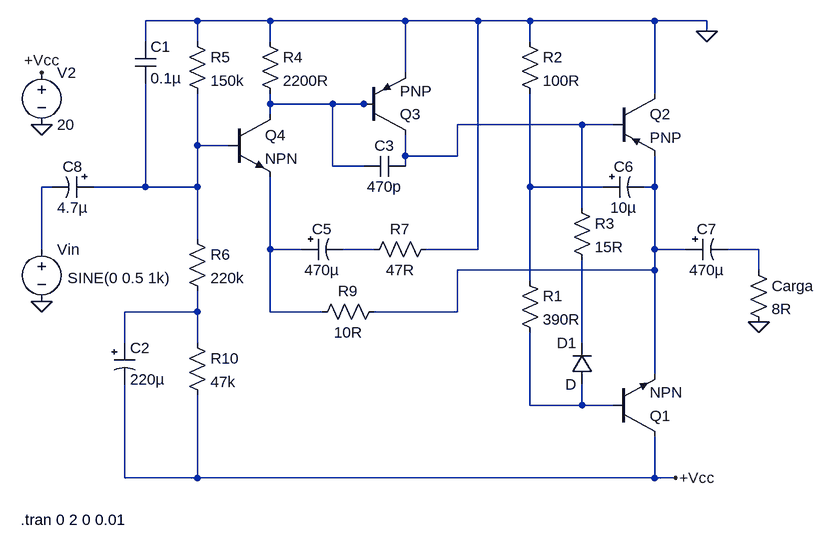
[diagram p0: schematic amp_20W.asc]
amp_20W.asc, the LTspice schematic file:
Version 4
SHEET 1 1108 736
WIRE 144 -48 64 -48
WIRE 256 -48 144 -48
WIRE 464 -48 256 -48
WIRE 576 -48 464 -48
WIRE 656 -48 576 -48
WIRE 848 -48 656 -48
WIRE 928 -48 848 -48
WIRE 928 -32 928 -48
WIRE 64 -16 64 -48
WIRE 144 -16 144 -48
WIRE 256 -16 256 -48
WIRE 656 -16 656 -48
WIRE 464 32 464 -48
WIRE 848 64 848 -48
WIRE 256 80 256 64
WIRE 352 80 256 80
WIRE 400 80 352 80
WIRE 416 80 400 80
WIRE 256 96 256 80
WIRE 736 112 544 112
WIRE 784 112 736 112
WIRE 144 144 144 64
WIRE 192 144 144 144
WIRE 464 160 464 128
WIRE 544 160 544 112
WIRE 544 160 464 160
WIRE 352 176 352 80
WIRE 400 176 352 176
WIRE 464 176 464 160
WIRE -80 208 -96 208
WIRE 64 208 64 48
WIRE 64 208 -16 208
WIRE 144 208 144 144
WIRE 144 208 64 208
WIRE 656 208 656 64
WIRE 768 208 656 208
WIRE 848 208 848 160
WIRE 848 208 832 208
WIRE 736 240 736 112
WIRE 144 288 144 208
WIRE -96 304 -96 208
WIRE 256 304 256 192
WIRE 304 304 256 304
WIRE 416 304 368 304
WIRE 576 304 576 -48
WIRE 576 304 496 304
WIRE 848 304 848 208
WIRE 896 304 848 304
WIRE 1008 304 960 304
WIRE 848 336 848 304
WIRE 848 336 544 336
WIRE 1008 336 1008 304
WIRE 656 352 656 208
WIRE 144 400 144 368
WIRE 144 400 32 400
WIRE 256 400 256 304
WIRE 336 400 256 400
WIRE 544 400 544 336
WIRE 544 400 416 400
WIRE 32 448 32 400
WIRE 144 448 144 400
WIRE 736 448 736 320
WIRE 848 496 848 336
WIRE 656 544 656 432
WIRE 736 544 736 512
WIRE 736 544 656 544
WIRE 784 544 736 544
WIRE 32 656 32 512
WIRE 144 656 144 528
WIRE 144 656 32 656
WIRE 848 656 848 592
WIRE 848 656 144 656
WIRE 880 656 848 656
FLAG 928 -32 0
FLAG 1008 416 0
FLAG 880 656 +Vcc
FLAG -96 32 +Vcc
FLAG -96 112 0
FLAG -96 384 0
SYMBOL npn 784 592 M180
SYMATTR InstName Q1
SYMBOL pnp 784 64 R0
SYMATTR InstName Q2
SYMBOL pnp 400 128 M180
SYMATTR InstName Q3
SYMBOL npn 192 96 R0
SYMATTR InstName Q4
SYMBOL res 640 336 R0
SYMATTR InstName R1
SYMATTR Value 390R
SYMBOL res 640 -32 R0
SYMATTR InstName R2
SYMATTR Value 100R
SYMBOL res 720 224 R0
SYMATTR InstName R3
SYMATTR Value 15R
SYMBOL res 240 -32 R0
SYMATTR InstName R4
SYMATTR Value 2200R
SYMBOL res 128 -32 R0
SYMATTR InstName R5
SYMATTR Value 150k
SYMBOL res 128 272 R0
SYMATTR InstName R6
SYMATTR Value 220k
SYMBOL res 512 288 R90
WINDOW 0 0 56 VBottom 2
WINDOW 3 32 56 VTop 2
SYMATTR InstName R7
SYMATTR Value 47R
SYMBOL res 432 384 R90
WINDOW 0 0 56 VBottom 2
WINDOW 3 32 56 VTop 2
SYMATTR InstName R9
SYMATTR Value 10R
SYMBOL res 128 432 R0
SYMATTR InstName R10
SYMATTR Value 47k
SYMBOL cap 48 -16 R0
SYMATTR InstName C1
SYMATTR Value 0.1µ
SYMBOL polcap 16 448 R0
WINDOW 3 24 56 Left 2
SYMATTR Value 220µ
SYMATTR InstName C2
SYMATTR Description Capacitor
SYMATTR Type cap
SYMATTR SpiceLine V=2 Irms=3.72678 Rser=0.018 Lser=0 mfg="KEMET" pn="A700D227M002ATE018" type="Al electrolytic"
SYMBOL cap 464 160 R90
WINDOW 0 0 32 VBottom 2
WINDOW 3 32 32 VTop 2
SYMATTR InstName C3
SYMATTR Value 470p
SYMBOL polcap 304 288 M90
WINDOW 0 0 32 VBottom 2
WINDOW 3 32 32 VTop 2
SYMATTR InstName C5
SYMATTR Value 470µ
SYMATTR Description Capacitor
SYMATTR Type cap
SYMATTR SpiceLine V=2 Irms=3.87298 Rser=0.015 Lser=0 mfg="KEMET" pn="A700X477M002ATE015" type="Al electrolytic"
SYMBOL polcap 768 192 M90
WINDOW 0 0 32 VBottom 2
WINDOW 3 32 32 VTop 2
SYMATTR InstName C6
SYMATTR Value 10µ
SYMATTR Description Capacitor
SYMATTR Type cap
SYMATTR SpiceLine V=6.3 Irms=2.21565 Rser=0.055 Lser=0 mfg="KEMET" pn="A700V106M006ATE055" type="Al electrolytic"
SYMBOL polcap 896 288 M90
WINDOW 0 0 32 VBottom 2
WINDOW 3 32 32 VTop 2
SYMATTR InstName C7
SYMATTR Value 470µ
SYMATTR Description Capacitor
SYMATTR Type cap
SYMATTR SpiceLine V=2 Irms=3.87298 Rser=0.015 Lser=0 mfg="KEMET" pn="A700X477M002ATE015" type="Al electrolytic"
SYMBOL polcap -16 192 R90
WINDOW 0 0 32 VBottom 2
WINDOW 3 32 32 VTop 2
SYMATTR InstName C8
SYMATTR Value 4.7µ
SYMATTR Description Capacitor
SYMATTR Type cap
SYMATTR SpiceLine V=25 Irms=24m Rser=5 Lser=0 mfg="Nichicon" pn="UPR1E4R7MAH" type="Al electrolytic"
SYMBOL diode 752 512 R180
WINDOW 0 24 64 Left 2
WINDOW 3 24 0 Left 2
SYMATTR InstName D1
SYMBOL res 992 320 R0
SYMATTR InstName Carga
SYMATTR Value 8R
SYMBOL voltage -96 288 R0
WINDOW 3 40 60 Left 2
WINDOW 123 0 0 Left 2
WINDOW 39 0 0 Left 2
SYMATTR Value SINE(0 0.5 1k)
SYMATTR InstName Vin
SYMBOL voltage -96 16 R0
WINDOW 123 0 0 Left 2
WINDOW 39 0 0 Left 2
SYMATTR InstName V2
SYMATTR Value 20
TEXT -128 720 Left 2 !.tran 0 2 0 0.01

The netlist it stands for:
* amp_20W.asc
Q1 +Vcc N012 N006 0 NPN
Q2 0 N002 N006 0 PNP
Q3 N002 N001 0 0 PNP
Q4 N001 N003 N007 0 NPN
R1 N005 N012 390R
R2 0 N005 100R
R3 N002 N011 15R
R4 0 N001 2200R
R5 0 N003 150k
R6 N003 N010 220k
R7 0 N008 47R
R9 N006 N007 10R
R10 N010 +Vcc 47k
C1 0 N003 0.1µ
C2 N010 +Vcc 220µ V=2 Irms=3.72678 Rser=0.018 Lser=0 mfg="KEMET" pn="A700D227M002ATE018" type="Al electrolytic"
C3 N002 N001 470p
C5 N007 N008 470µ V=2 Irms=3.87298 Rser=0.015 Lser=0 mfg="KEMET" pn="A700X477M002ATE015" type="Al electrolytic"
C6 N005 N006 10µ V=6.3 Irms=2.21565 Rser=0.055 Lser=0 mfg="KEMET" pn="A700V106M006ATE055" type="Al electrolytic"
C7 N006 N009 470µ V=2 Irms=3.87298 Rser=0.015 Lser=0 mfg="KEMET" pn="A700X477M002ATE015" type="Al electrolytic"
C8 N003 N004 4.7µ V=25 Irms=24m Rser=5 Lser=0 mfg="Nichicon" pn="UPR1E4R7MAH" type="Al electrolytic"
D1 N012 N011 D
R§Carga N009 0 8R
Vin N004 0 SINE(0 0.5 1k)
V2 +Vcc 0 20
.model D D
.lib standard.dio
.model NPN NPN
.model PNP PNP
.lib standard.bjt
.tran 0 2 0 0.01
.backanno
.end